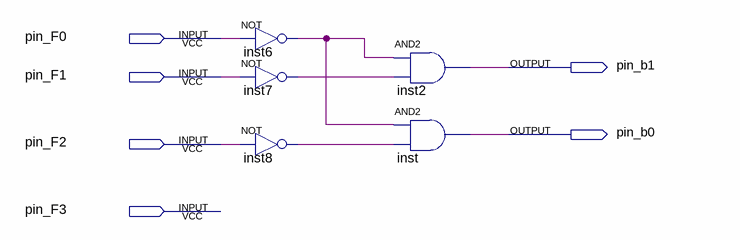
[diagram p0: schematic sheet]
// Quartus schematic Block1.bdf as structural Verilog: 5 symbols, 6 pins
module Block1 (
  input  pin_F0,
  input  pin_F1,
  input  pin_F2,
  input  pin_F3,
  output pin_b1,
  output pin_b0
);

  wire inst6_out, inst7_out, inst8_out;

  not inst6 (inst6_out, pin_F0);
  not inst7 (inst7_out, pin_F1);
  not inst8 (inst8_out, pin_F2);
  and inst2 (pin_b1, inst6_out, inst7_out);
  and inst (pin_b0, inst6_out, inst8_out);
endmodule
